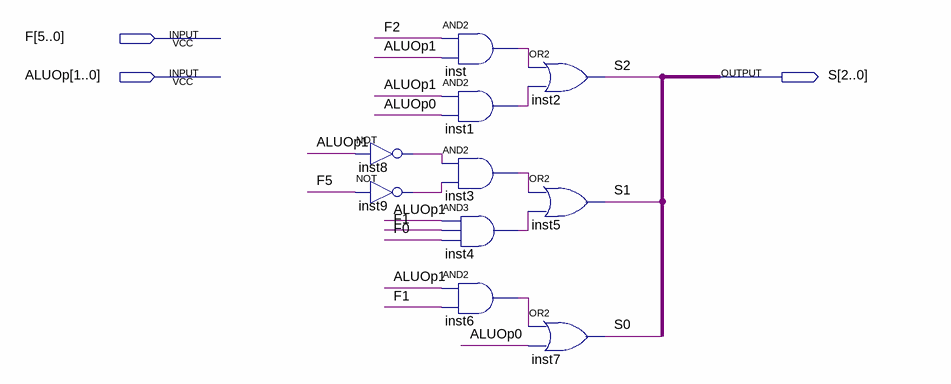
[diagram p0: schematic sheet]
// Quartus schematic ALUControl.bdf as structural Verilog: 10 symbols, 3 pins
module ALUControl (
  input  [5:0] F,
  input  [1:0] ALUOp,
  output [2:0] S
);

  wire inst1_out, inst3_out, inst4_out, inst6_out, inst8_out, inst9_out, inst_out;

  not inst8 (inst8_out, ALUOp[1]);
  not inst9 (inst9_out, F[5]);
  and inst (inst_out, F[2], ALUOp[1]);
  and inst1 (inst1_out, ALUOp[1], ALUOp[0]);
  and inst3 (inst3_out, inst8_out, inst9_out);
  and inst4 (inst4_out, ALUOp[1], F[1], F[0]);
  and inst6 (inst6_out, ALUOp[1], F[1]);
  or inst2 (S[2], inst_out, inst1_out);
  or inst5 (S[1], inst3_out, inst4_out);
  or inst7 (S[0], inst6_out, ALUOp[0]);
endmodule
